# Altium schematic sheet Power_Supply.SchDoc
size A
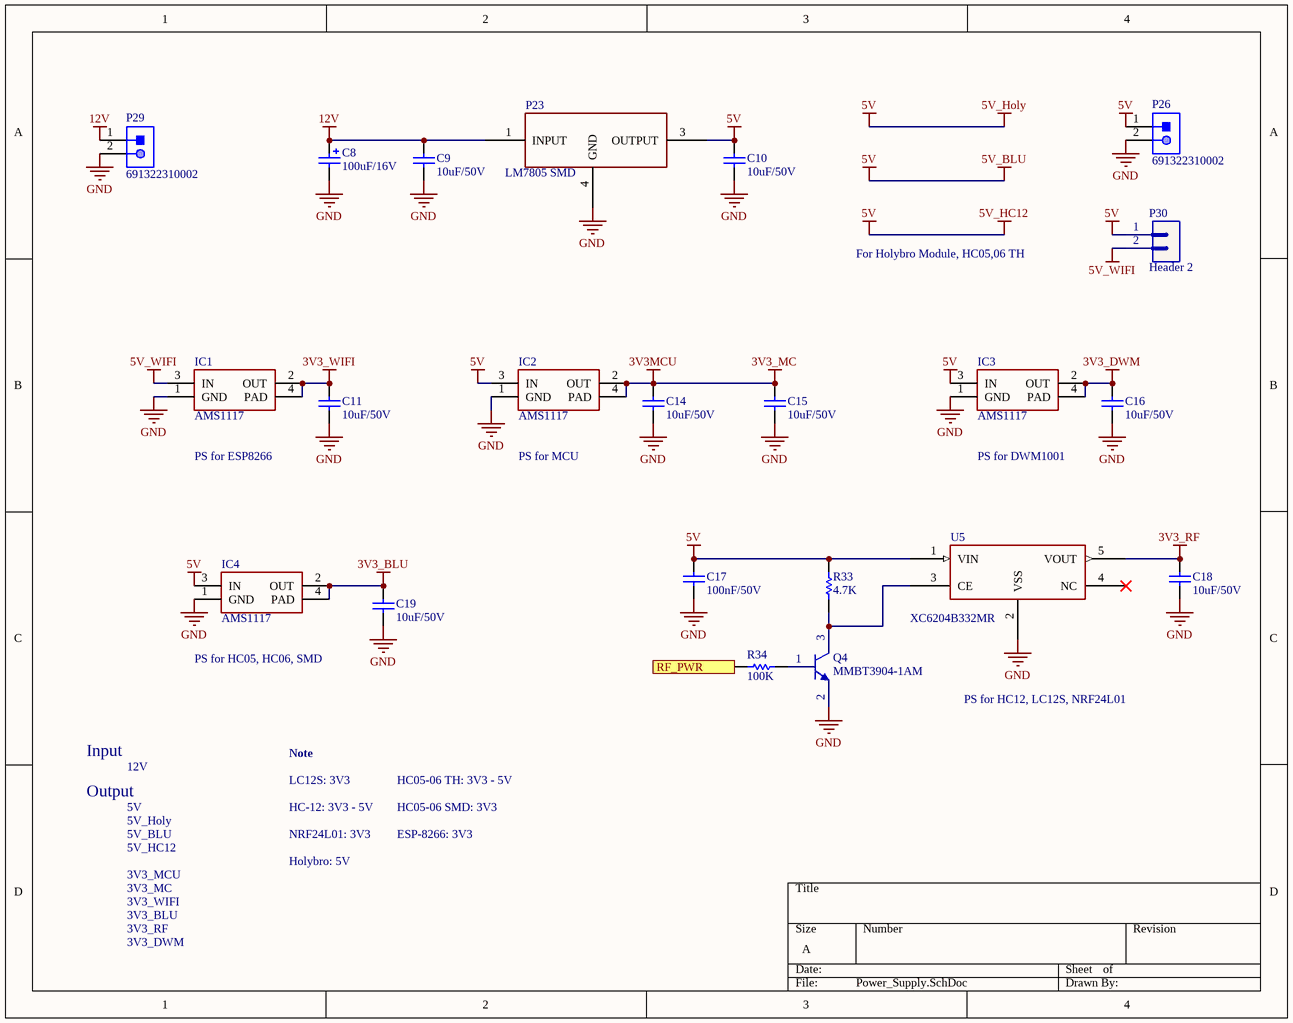
[diagram p0: Power_Supply.SchDoc]

## Parts
C8  value 100uF/16V  [CAP-SM-AL-SIZE-D-D6L6]  (hidden comment: Cap-Al-100uF-16V-D6L5)
C9  value 10uF/50V  [CAP-SM-0805]  (hidden comment: Cap-10uF-50V-0805)
C10  value 10uF/50V  [CAP-SM-0805]  (hidden comment: Cap-10uF-50V-0805)
C11  value 10uF/50V  [CAP-SM-0805]  (hidden comment: Cap-10uF-50V-0805)
C14  value 10uF/50V  [CAP-SM-0805]  (hidden comment: Cap-10uF-50V-0805)
C15  value 10uF/50V  [CAP-SM-0805]  (hidden comment: Cap-10uF-50V-0805)
C16  value 10uF/50V  [CAP-SM-0805]  (hidden comment: Cap-10uF-50V-0805)
C17  value 100nF/50V  [CAP-SM-0805]  (hidden comment: Cap-100nF-50V-0805)
C18  value 10uF/50V  [CAP-SM-0805]  (hidden comment: Cap-10uF-50V-0805)
C19  value 10uF/50V  [CAP-SM-0805]  (hidden comment: Cap-10uF-50V-0805)
IC1  AMS1117  [SOT223]
IC2  AMS1117  [SOT223]
IC3  AMS1117  [SOT223]
IC4  AMS1117  [SOT223]
P23  LM7805 SMD  [D2PAK_STM]
P26  691322310002  [691322310002]
P29  691322310002  [691322310002]
P30  Header 2  [JP2]
Q4  MMBT3904-1AM  [SOT23_NEX]
R33  value 4.7K  [RES-SM-0805]  (hidden comment: Res-4.7K-0805)
R34  value 100K  [RES-SM-0805]  (hidden comment: Res-100K-0805)
U5  XC6204B332MR  [XC6204/05_SOT-00]

## Ports
RF_PWR (in)

## Nets
3V3_BLU: C19.2 IC4.2(OUT) IC4.4(PAD)
3V3_DWM: C16.2 IC3.2(OUT) IC3.4(PAD)
3V3_MC: C14.2 C15.2 IC2.2(OUT) IC2.4(PAD)  [also labelled 3V3MCU]
3V3_RF: C18.2 U5.5(VOUT)
3V3_WIFI: C11.2 IC1.2(OUT) IC1.4(PAD)
5V: C10.2 C17.2 IC2.3(IN) IC3.3(IN) IC4.3(IN) P23.3(OUTPUT) P26.1 P30.1 R33.2 U5.1(VIN)  [also labelled 5V_BLU, 5V_HC12, 5V_Holy]
5V_WIFI: IC1.3(IN) P30.2
12V: C8.1 C9.1 P23.1(INPUT) P29.1
GND: C8.2 C9.2 C10.1 C11.1 C14.1 C15.1 C16.1 C17.1 C18.1 C19.1 IC1.1(GND) IC2.1(GND) IC3.1(GND) IC4.1(GND) P23.4(GND) P26.2 P29.2 Q4.2(E) U5.2(VSS)
RF_PWR: R34.1 ; port RF_PWR
NetQ4_1: Q4.1(B) R34.2
NetQ4_3: Q4.3(C) R33.1 U5.3(CE)

Not connected (* = marked no-connect by the designer): U5 4(NC)*

## Notes on the sheet
- For Holybro Module, HC05,06 TH
- PS for ESP8266
- PS for MCU
- PS for DWM1001
- PS for HC05, HC06, SMD
- PS for HC12, LC12S, NRF24L01
- Input
- 12V
- Note
- Output
- 5V_Holy
- 5V_BLU
- 5V
- LC12S: 3V3
- HC-12: 3V3 - 5V
- NRF24L01: 3V3
- HC05-06 TH: 3V3 - 5V
- HC05-06 SMD: 3V3
- ESP-8266: 3V3
- 5V_HC12
- 3V3_MC
- 3V3_MCU
- 3V3_WIFI
- Holybro: 5V
- 3V3_BLU
- 3V3_RF
- 3V3_DWM

## Library data of the parts
C8 = Cap-Al-100uF-16V-D6L5: CAP ALUM 100UF 20% 16V SMD; Manufacturer: Nichicon; Manufacturer Part Number: UWX1C101MCL1GB; Local Supplier: thegioiic; Local Supplier Link: https://thegioiic.com/products/tu-nhom-smd-100uf-16v-d6-3l5-4; Supplier 1: Digikey; Supplier 1 Part Number: 493-2105-1-ND; Supplier 1 Link: https://www.digikey.com/product-detail/en/nichicon/UWX1C101MCL1GB/493-2105-1-ND/590080
C9-C11 C14-C16 C18 C19 = Cap-10uF-50V-0805: CAP CER 10UF 50V X5R 0805; Manufacturer: Yageo; Manufacturer Part Number: CC0805KKX5R9BB106; Local Supplier: thegioiic; Local Supplier Link: https://thegioiic.com/products/tu-10uf-50v-0805; Supplier 1: Digikey; Supplier 1 Link: https://www.digikey.com/product-detail/en/yageo/CC0805KKX5R9BB106/311-3499-2-ND/7164383; Supplier 1 Part Number: 311-3499-2-ND
C17 = Cap-100nF-50V-0805: CAP CER 0.1UF 50V Y5V 0805; Manufacturer: Samsung Electro-Mechanics; Manufacturer Part Number: CL21F104ZBCNNNC; Local Supplier: thegioiic; Local Supplier Link: https://thegioiic.com/products/tu-100nf-0-1uf-50v-0805; Supplier 1: Digikey; Supplier 1 Part Number: 1276-1007-1-ND; Supplier 1 Link: https://www.digikey.com/product-detail/en/samsung-electro-mechanics/CL21F104ZBCNNNC/1276-1007-1-ND/3889093
IC1-IC4 = AMS1117: Available in 1.8V, 2.5V, 2.85V, 3.3V, 5V, and  Adjustable Versions; Value: LM317
P26 P29 = 691322310002: WR-TBL Serie 322 Horizontal PCB Header, Pluggable, pitch 3.81mm, 2p; Compliance: RoHS; Modularity: No; Pin Number: 2; Rated Current [UL]: 10A; Working Voltage [UL]: 300VAC; ComponentLink1Description: Manufacturer; ComponentLink1URL: http://www.we-online.de; ComponentLink2URL: https://katalog.we-online.de/em/datasheet/691322310002.pdf; ComponentLink2Description: Datasheet; Mounting Technology: THT; Part Number: 691322310002; Packaging: Box; Operating Temperature: -40 to +105degC; PCB/Cable/Panel: PCB; Pitch: 3.81mm; Published Date: October 2019; Type: Horizontal; Publisher: Wurth Elektronik; Application: Pluggable
P30 = Header 2: Header, 2-Pin; LatestRevisionDate: 17-Jul-2002; LatestRevisionNote: Re-released for DXP Platform.; Publisher: Altium Limited
R33 = Res-4.7K-0805: RES SMD 4.7K OHM 5% 1/8W 0805; Manufacturer: Yageo; Manufacturer Part Number: RC0805JR-074K7L; Local Supplier: thegioiic; Local Supplier Link: https://thegioiic.com/products/dien-tro-4-7k-ohm-0805-5; Supplier 1: Digikey; Supplier 1 Link: https://www.digikey.com/product-detail/en/yageo/RC0805JR-074K7L/311-4.7KARCT-ND/731274; Supplier 1 Part Number: 311-4.7KARCT-ND
R34 = Res-100K-0805: RES 0 OHM JUMPER 0805; Manufacturer: Vishay Dale; Manufacturer Part Number: WSL080500000ZEA9; Local Supplier: thegioiic; Local Supplier Link: https://thegioiic.com/products/dien-tro-0-ohm-0805-5; Supplier 1: Digikey; Supplier 1 Link: https://www.digikey.com/product-detail/en/vishay-dale/WSL080500000ZEA9/541-3928-1-ND/7423223; Supplier 1 Part Number: 541-3928-1-ND
U5 = XC6204B332MR: Vendor: Torex Semiconductor; Built_By: EMA_UL_Team; SourceLibrary: Torex_2016-07-05_1; Manufacturer_Part_Number: XC6204B332MR; Copyright: Copyright (C) 2018 Accelerated Designs. All rights reserved; RefDes: RefDes; Type: DEV
P23 = LM7805 SMD: Local Supplier: *; Local Supplier Link: *; Local Supplier Part Number: *; Mannufacture: *; Mannufacture Part Number: *